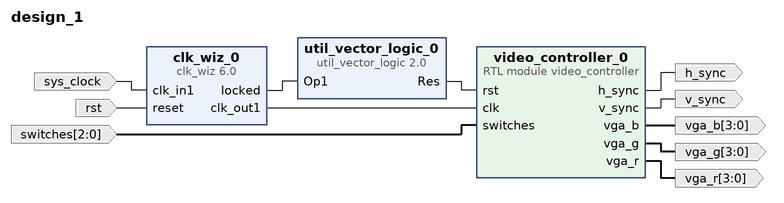
[diagram p0: block diagram of the top level]
# Vivado block design design_1, xc7z020clg484-1, Vivado 2020.2
create_bd_design design_1

create_bd_port -dir I rst
create_bd_port -dir I sys_clock
create_bd_port -dir O -from 3 -to 0 vga_g
create_bd_port -dir O -from 3 -to 0 vga_b
create_bd_port -dir O -from 3 -to 0 vga_r
create_bd_port -dir O h_sync
create_bd_port -dir O v_sync
create_bd_port -dir I -from 2 -to 0 switches

create_bd_cell -type ip -vlnv xilinx.com:ip:clk_wiz:6.0 clk_wiz_0
set_property -dict [list \
  CONFIG.CLKOUT1_JITTER 217.614 \
  CONFIG.CLKOUT1_PHASE_ERROR 245.344 \
  CONFIG.CLKOUT1_REQUESTED_OUT_FREQ 148.5 \
  CONFIG.MMCM_CLKFBOUT_MULT_F 37.125 \
  CONFIG.MMCM_CLKOUT0_DIVIDE_F 6.250 \
  CONFIG.MMCM_DIVCLK_DIVIDE 4 \
] [get_bd_cells clk_wiz_0]
create_bd_cell -type ip -vlnv xilinx.com:ip:util_vector_logic:2.0 util_vector_logic_0
set_property -dict {CONFIG.C_OPERATION not CONFIG.C_SIZE 1} [get_bd_cells util_vector_logic_0]
create_bd_cell -type module -reference video_controller video_controller_0

# ---- connections ----

connect_bd_net [get_bd_pins clk_wiz_0/locked] [get_bd_pins util_vector_logic_0/Op1]
connect_bd_net [get_bd_ports sys_clock] [get_bd_pins clk_wiz_0/clk_in1]
connect_bd_net [get_bd_ports rst] [get_bd_pins clk_wiz_0/reset]
connect_bd_net [get_bd_pins video_controller_0/vga_g] [get_bd_ports vga_g]
connect_bd_net [get_bd_pins video_controller_0/vga_b] [get_bd_ports vga_b]
connect_bd_net [get_bd_pins video_controller_0/vga_r] [get_bd_ports vga_r]
connect_bd_net [get_bd_pins video_controller_0/v_sync] [get_bd_ports v_sync]
connect_bd_net [get_bd_pins video_controller_0/h_sync] [get_bd_ports h_sync]
connect_bd_net [get_bd_pins clk_wiz_0/clk_out1] [get_bd_pins video_controller_0/clk]
connect_bd_net [get_bd_pins util_vector_logic_0/Res] [get_bd_pins video_controller_0/rst]
connect_bd_net [get_bd_ports switches] [get_bd_pins video_controller_0/switches]

validate_bd_design
save_bd_design
